# EAGLE design schema (EAGLE 8.7.1)
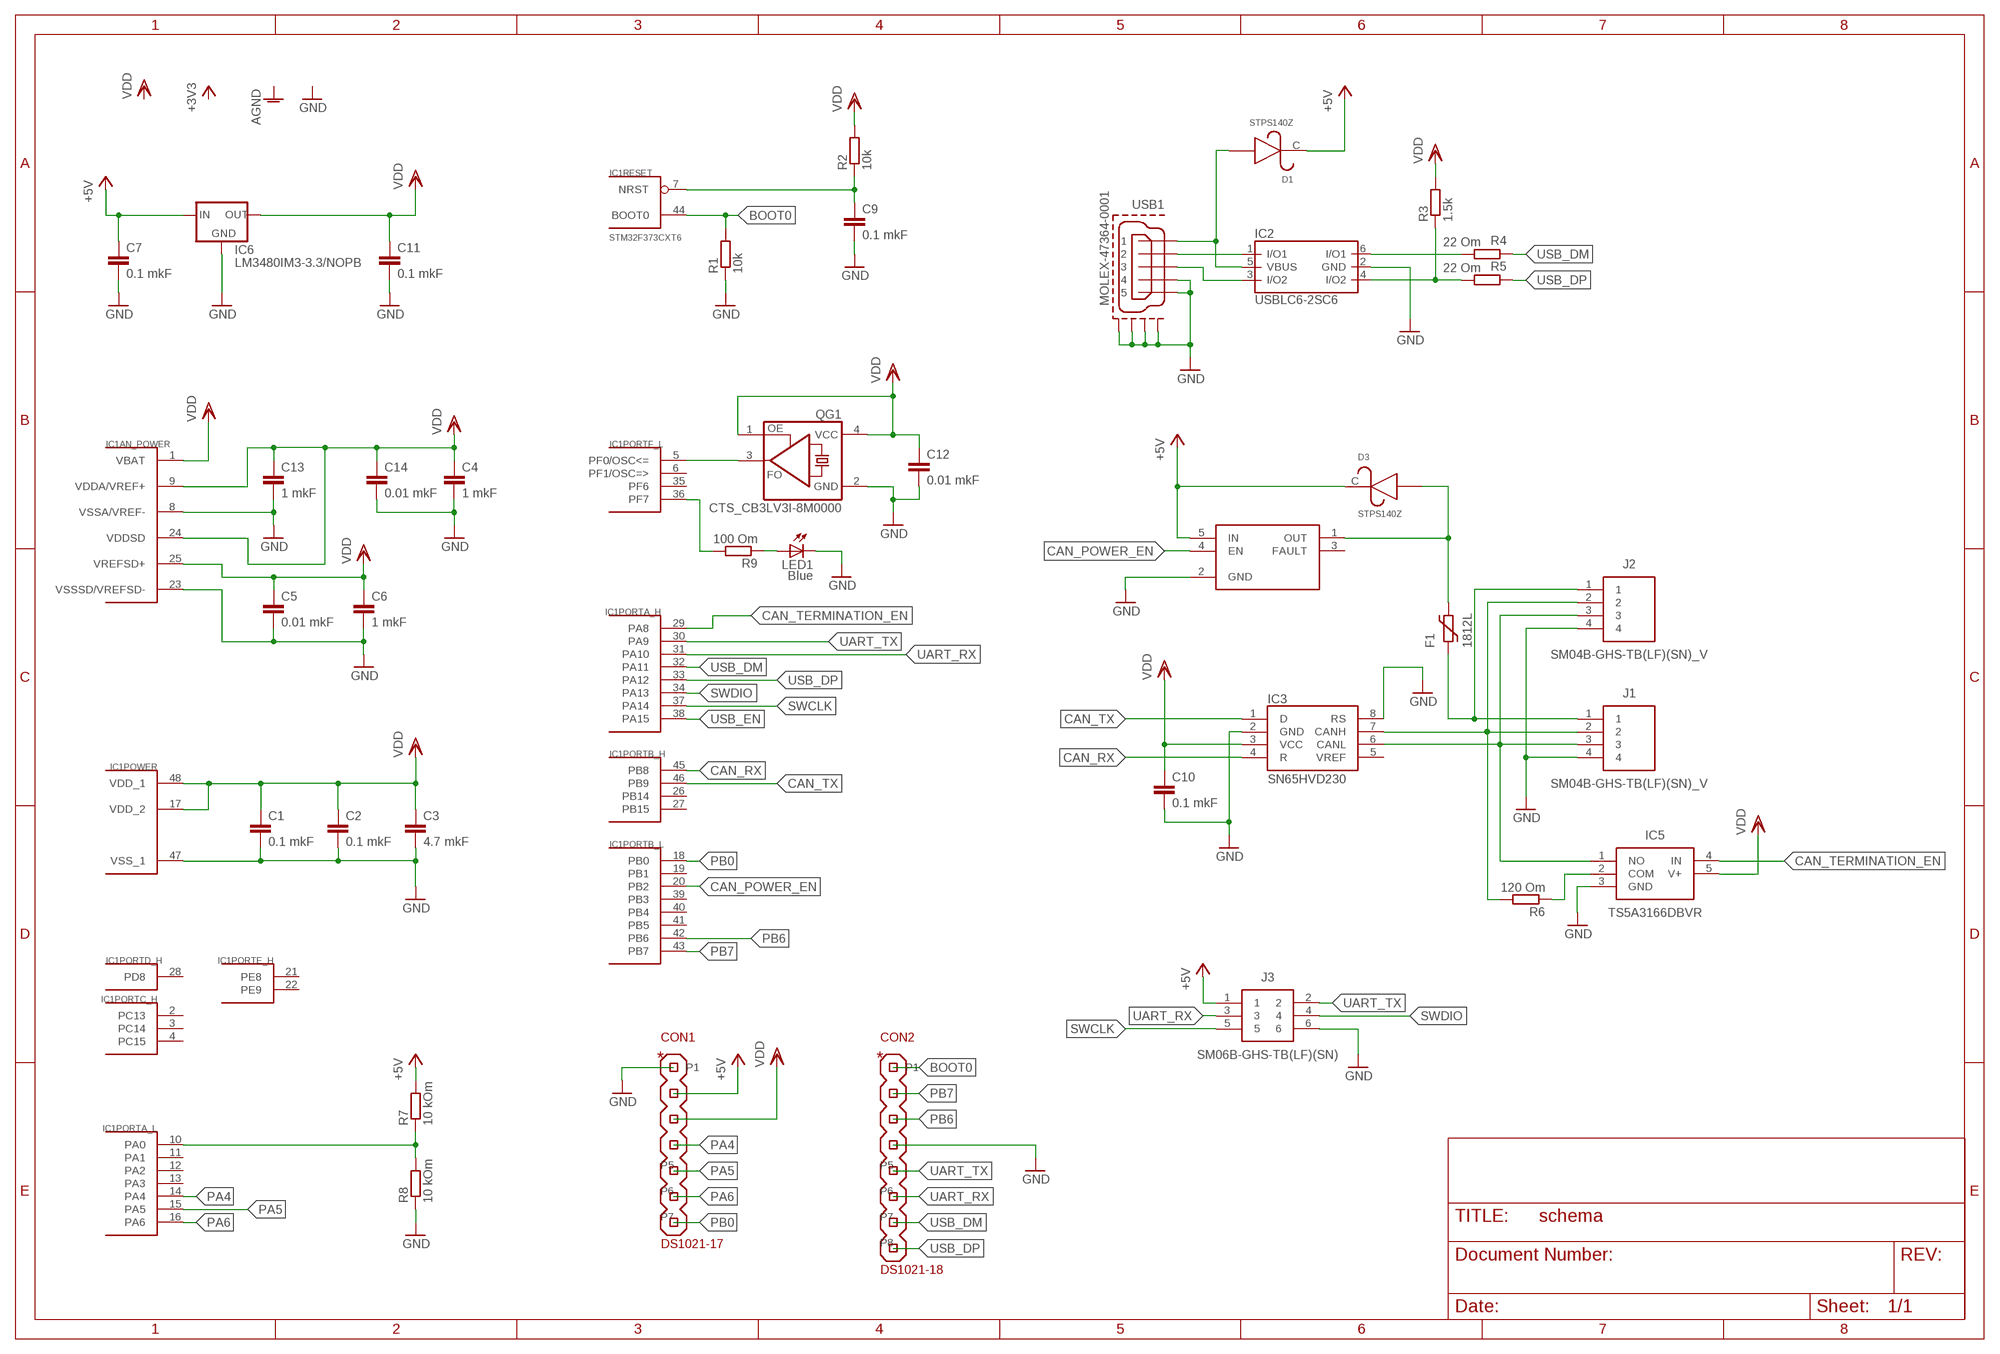
[diagram p0: schematic, sheet 1]

## Parts
C1  0.1 mkF  C-EUC0603  [C0603]
C2  0.1 mkF  C-EUC0603  [C0603]
C3  4.7 mkF  C-EUC0805  [C0805]
C4  1 mkF  C-EUC0603  [C0603]
C5  0.01 mkF  C-EUC0603  [C0603]
C6  1 mkF  C-EUC0603  [C0603]
C7  0.1 mkF  C-EUC0603  [C0603]
C9  0.1 mkF  C-EUC0603  [C0603]
C10  0.1 mkF  C-EUC0603  [C0603]
C11  0.1 mkF  C-EUC0603  [C0603]
C12  0.01 mkF  C-EUC0603  [C0603]
C13  1 mkF  C-EUC0603  [C0603]
C14  0.01 mkF  C-EUC0603  [C0603]
CON1  DS1021-17  [DS1021-1*7]
CON2  DS1021-18  [DS1021-1*8]
D1  STPS140Z  [SOD123]
D3  STPS140Z  [SOD123]
F1  1812L  [1812L]
IC1  STM32F373CXT6  [TQFP48]
IC2  USBLC6-2SC6  [SOT23-6L]
IC3  SN65HVD230  [SO8]
IC5  TS5A3166DBVR  [SOT23-5]
IC6  LM3480IM3-3.3/NOPB  [SOT23]
IC7  STMPS2171STR  [SOT23-5L]
J1  SM04B-GHS-TB(LF)(SN)_V  [SM04B-GHS-TB]
J2  SM04B-GHS-TB(LF)(SN)_V  [SM04B-GHS-TB]
J3  SM06B-GHS-TB(LF)(SN)  [SM06B-GHS-TB]
LED1  Blue  LEDCHIPLED_0603  [CHIPLED_0603]
QG1  CTS_CB3LV3I-8M0000  [CTS_CB3]
R1  10k  R-EU_R0603  [R0603]
R2  10k  R-EU_R0603  [R0603]
R3  1.5k  R-EU_R0603  [R0603]
R4  22 Om  R-EU_R0603  [R0603]
R5  22 Om  R-EU_R0603  [R0603]
R6  120 Om  R-EU_R1206  [R1206]
R7  10 kOm  R-EU_R0603  [R0603]
R8  10 kOm  R-EU_R0603  [R0603]
R9  100 Om  R-EU_R0603  [R0603]
USB1  MOLEX-47364-0001  [MOLEX-47364-0001]

## Nets
+5V: C7.1 CON1.P2 D1.C D3.C IC6.2(IN) IC7.5(IN) J3.1 R7.2
BOOT0: CON2.P1 IC1.44(RESET:BOOT0) R1.2
CAN_POWER_EN: IC1.20(PORTB_L:PB2) IC7.4(EN)
CAN_RX: IC1.45(PORTB_H:PB8) IC3.4(R)
CAN_TERMINATION_EN: IC1.29(PORTA_H:PA8) IC5.4(IN)
CAN_TX: IC1.46(PORTB_H:PB9) IC3.1(D)
GND: C1.2 C2.2 C3.2 C4.2 C5.2 C6.2 C7.2 C9.2 C10.2 C11.2 C12.2 C13.2 C14.2 CON1.P1 CON2.P4 IC1.8(AN_POWER:VSSA/VREF-) IC1.23(AN_POWER:VSSSD/VREFSD-) IC1.47(POWER:VSS_1) IC2.2(GND) IC3.2(GND) IC3.8(RS) IC5.3(GND) IC6.3(GND) IC7.2(GND) J1.4 J2.4 J3.6 LED1.C QG1.2(GND) R1.1 R8.1 USB1.4 USB1.5 USB1.GND1 USB1.GND2 USB1.GND3 USB1.GND4
N$2: C9.1 IC1.7(RESET:NRST) R2.1
N$3: IC1.5(PORTF_L:PF0/OSC<=) QG1.3(FO)
N$4: IC3.7(CANH) J1.2 J2.2 R6.2
N$5: IC2.1(I/O1) USB1.2
N$6: IC2.3(I/O2) USB1.3
N$7: IC2.6(I/O1) R4.2
N$8: IC2.4(I/O2) R3.1 R5.2
N$9: IC3.6(CANL) IC5.1(NO) J1.3 J2.3
N$10: D3.A F1.2 IC7.1(OUT)
N$11: IC5.2(COM) R6.1
N$12: F1.1 J1.1 J2.1
N$13: D1.A IC2.5(VBUS) USB1.1
N$15: IC1.10(PORTA_L:PA0) R7.1 R8.2
N$16: IC1.36(PORTF_L:PF7) R9.2
N$17: LED1.A R9.1
PA4: CON1.P4 IC1.14(PORTA_L:PA4)
PA5: CON1.P5 IC1.15(PORTA_L:PA5)
PA6: CON1.P6 IC1.16(PORTA_L:PA6)
PB0: CON1.P7 IC1.18(PORTB_L:PB0)
PB6: CON2.P3 IC1.42(PORTB_L:PB6)
PB7: CON2.P2 IC1.43(PORTB_L:PB7)
SWCLK: IC1.37(PORTA_H:PA14) J3.5
SWDIO: IC1.34(PORTA_H:PA13) J3.4
UART_RX: CON2.P6 IC1.31(PORTA_H:PA10) J3.3
UART_TX: CON2.P5 IC1.30(PORTA_H:PA9) J3.2
USB_DM: CON2.P7 IC1.32(PORTA_H:PA11) R4.1
USB_DP: CON2.P8 IC1.33(PORTA_H:PA12) R5.1
USB_EN: IC1.38(PORTA_H:PA15)
VDD: C1.1 C2.1 C3.1 C4.1 C5.1 C6.1 C10.1 C11.1 C12.1 C13.1 C14.1 CON1.P3 IC1.1(AN_POWER:VBAT) IC1.9(AN_POWER:VDDA/VREF+) IC1.17(POWER:VDD_2) IC1.24(AN_POWER:VDDSD) IC1.25(AN_POWER:VREFSD+) IC1.48(POWER:VDD_1) IC3.3(VCC) IC5.5(V+) IC6.1(OUT) QG1.1(OE) QG1.4(VCC) R2.2 R3.2
Unconnected: IC1.2(PORTC_H:PC13) IC1.3(PORTC_H:PC14) IC1.4(PORTC_H:PC15) IC1.6(PORTF_L:PF1/OSC=>) IC1.11(PORTA_L:PA1) IC1.12(PORTA_L:PA2) IC1.13(PORTA_L:PA3) IC1.19(PORTB_L:PB1) IC1.21(PORTE_H:PE8) IC1.22(PORTE_H:PE9) IC1.26(PORTB_H:PB14) IC1.27(PORTB_H:PB15) IC1.28(PORTD_H:PD8) IC1.35(PORTF_L:PF6) IC1.39(PORTB_L:PB3) IC1.40(PORTB_L:PB4) IC1.41(PORTB_L:PB5) IC3.5(VREF) IC7.3(FAULT)

## Library data of the parts
C1-C7 C9-C14 = resistor:C-EU: CAPACITOR, European symbol
CON1 = Конекторы:DS1021-1*7
CON2 = Конекторы:DS1021-1*8
D1 D3 = Диоды:STPS140Z: POWER SCHOTTKY RECTIFIER STMicroelectronics
F1 = ptc-polyfuse:1812L: FUSE
IC1 = stm32:STM32F373CXT6: ST STM32F373CBT6 48pin LQFP
IC2 = st:USBLC6-2SC6: ST Microelectronics USBLC6-2SC6 VERY LOW CAPACITANCE ESD PROTECTION Защитный диод - [SOT-23-6]; Примечание: USB
IC3 = texas_instruments:SN65HVD230
IC5 = texas_instruments:TS5A3166DBVR: Texas Instruments TS5A3166 - 0.9-Ω SPST Analog Switch
IC6 = Texas Instruments:LM3480: Texas Instruments 100 mA, SOT-23, Quasi Low-Dropout Linear Voltage Regulator <https://componentsearchengine.com/Images/3/LM3480IM3-3.3_NOPB.jpg> Source: Datasheet <http://www.ti.com/lit/gpn/lm3480>
IC7 = st:STMPS21: Enhanced single channel power switches STMPS2141, STMPS2151, STMPS2161, STMPS2171
J1 J2 = SM04B-GHS-TB(LF)(SN):SM04B-GHS-TB(LF)(SN)_V: JST GH Series, 1.25mm Pitch 4 Way Right Angle PCB Header, Solder Termination, 1A <https://componentsearchengine.com/Images/3/SM04B-GHS-TB%28LF%29%28SN%29.jpg> Source: Datasheet <http://uk.rs-online.com/web/p/products/7521797>; DESCRIPTION: JST GH Series, 1.25mm Pitch 4 Way Right Angle PCB Header, Solder Termination, 1A; HEIGHT: mm; MANUFACTURER_NAME: JST (JAPAN SOLDERLESS TERMINALS); MANUFACTURER_PART_NUMBER: SM04B-GHS-TB(LF)(SN); RS_PART_NUMBER: 7521797; SUPPLIER_NAME: RS
J3 = SM06B-GHS-TB(LF)(SN):SM06B-GHS-TB(LF)(SN): GH 1.25mm header side entry 6 way JST GH Series, 1.25mm Pitch 6 Way Right Angle PCB Header, Solder Termination, 1A <https://componentsearchengine.com/Images/3/SM06B-GHS-TB%28LF%29%28SN%29.jpg> Source: Datasheet <http://docs-europe.electrocomponents.com/webdocs/13ed/0900766b813ed077.pdf>; DESCRIPTION: GH 1.25mm header side entry 6 way JST GH Series, 1.25mm Pitch 6 Way Right Angle PCB Header, Solder Termination, 1A; HEIGHT: mm; MANUFACTURER_NAME: JST (JAPAN SOLDERLESS TERMINALS); MANUFACTURER_PART_NUMBER: SM06B-GHS-TB(LF)(SN); RS_PART_NUMBER: 7521800; SUPPLIER_NAME: RS
LED1 = led:LED: LED OSRAM: - CHIPLED LG R971, LG N971, LY N971, LG Q971, LY Q971, LO R971, LY R971 LH N974, LH R974 LS Q976, LO Q976, LY Q976 LO Q996 - Hyper CHIPLED LW Q18S LB Q993, LB Q99A, LB R99A - SideLED LS A670, LO A670, LY A670, LG A670, LP A670 LB A673, LV A673, LT A673, LW A673 LH A674 LY A675 LS A676, LA A676, LO A676, LY A676, LW A676 LS A679, LY A679, LG A679 - Hyper Micro SIDELED® LS Y876, LA Y876, LO Y876, LY Y876 LT Y87S - SmartLED LW L88C, LW L88S LB L89C, LB L89S, LG L890 LS L89K, LO L89K, LY L89K LS L896, LA L896, LO L896, LY L896 - TOPLED LS T670, LO T670, LY T670, LG T670, LP T670 LSG T670, LSP T670, LSY T670, LOP T670, LYG T670 LG T671, LOG T671, LSG T671 LB T673, LV T673, LT T673, LW T673 LH T674 LS T676, LA T676, LO T676, LY T676, LB T676, LH T676, LSB T676, LW T676 LB T67C, LV T67C, LT T67C, LS T67K, LO T67K, LY T67K, LW E67C LS E67B, LA E67B, LO E67B, LY E67B, LB E67C, LV E67C, LT E67C LW T67C LS T679, LY T679, LG T679 LS T770, LO T770, LY T770, LG T770, LP T770 LB T773, LV T773, LT T773, LW T773 LH T774 LS E675, LA E675, LY E675, LS T675 LS T776, LA T776, LO T776, LY T776, LB T776 LHGB T686 LT T68C, LB T68C - Hyper Mini TOPLED® LB M676 - Mini TOPLED Santana® LG M470 LS M47K, LO M47K, LY M47K Source: http://www.osram.convergy.de LUXEON: - LUMILED® LXK2-PW12-R00, LXK2-PW12-S00, LXK2-PW14-U00, LXK2-PW14-V00 LXK2-PM12-R00, LXK2-PM12-S00, LXK2-PM14-U00 LXK2-PE12-Q00, LXK2-PE12-R00, LXK2-PE12-S00, LXK2-PE14-T00, LXK2-PE14-U00 LXK2-PB12-K00, LXK2-PB12-L00, LXK2-PB12-M00, LXK2-PB14-N00, LXK2-PB14-P00, LXK2-PB14-Q00 LXK2-PR12-L00, LXK2-PR12-M00, LXK2-PR14-Q00, LXK2-PR14-R00 LXK2-PD12-Q00, LXK2-PD12-R00, LXK2-PD12-S00 LXK2-PH12-R00, LXK2-PH12-S00 LXK2-PL12-P00, LXK2-PL12-Q00, LXK2-PL12-R00 Source: www.luxeon.com KINGBRIGHT: KA-3528ASYC Source: www.kingbright.com
QG1 = Crystals:CTS_CB3LV: CTS CB3LV Exampe: 8MHz - CB3LV-3I-8M0000
R1-R9 = resistor:R-EU_: RESISTOR, European symbol
USB1 = Конекторы:MOLEX-47364-0001: MICRO USB B, BOTTOM MOUNT

## Board
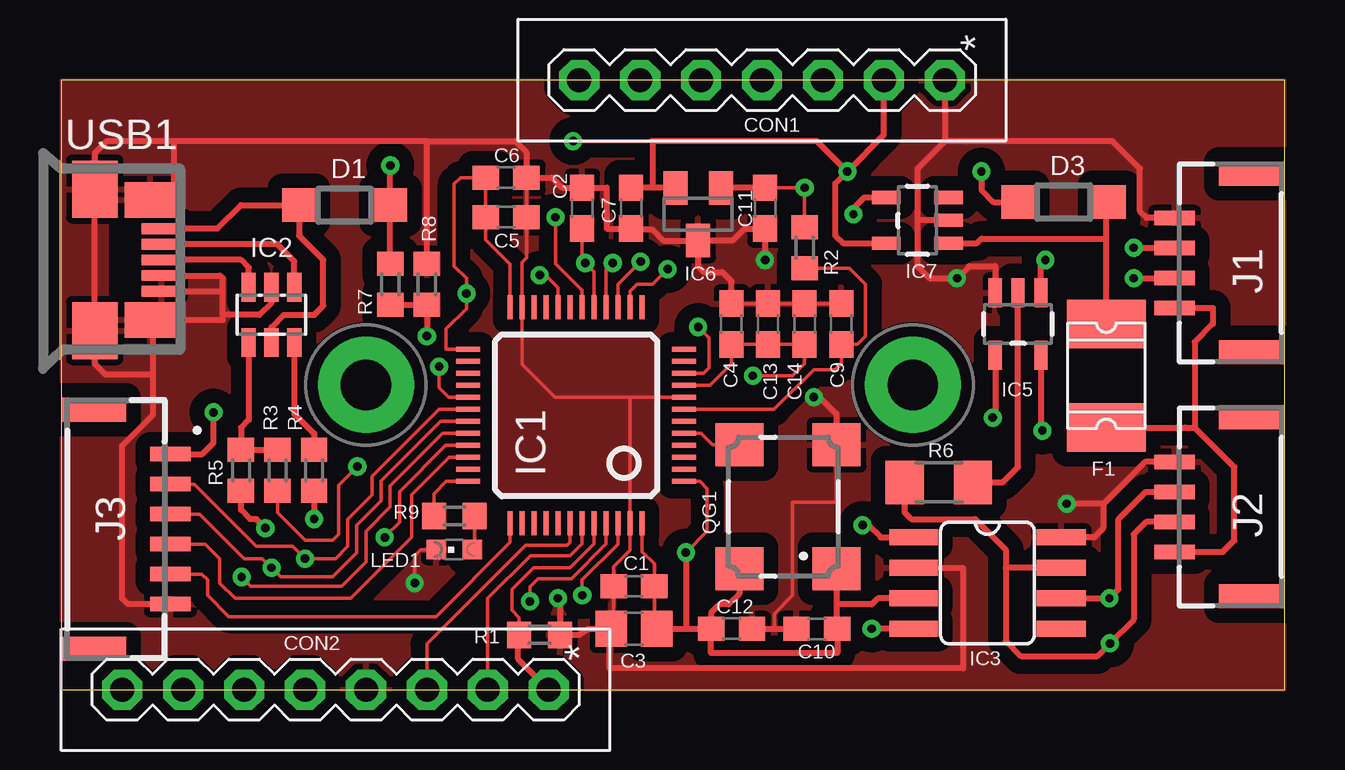
[diagram p1: board, top side]
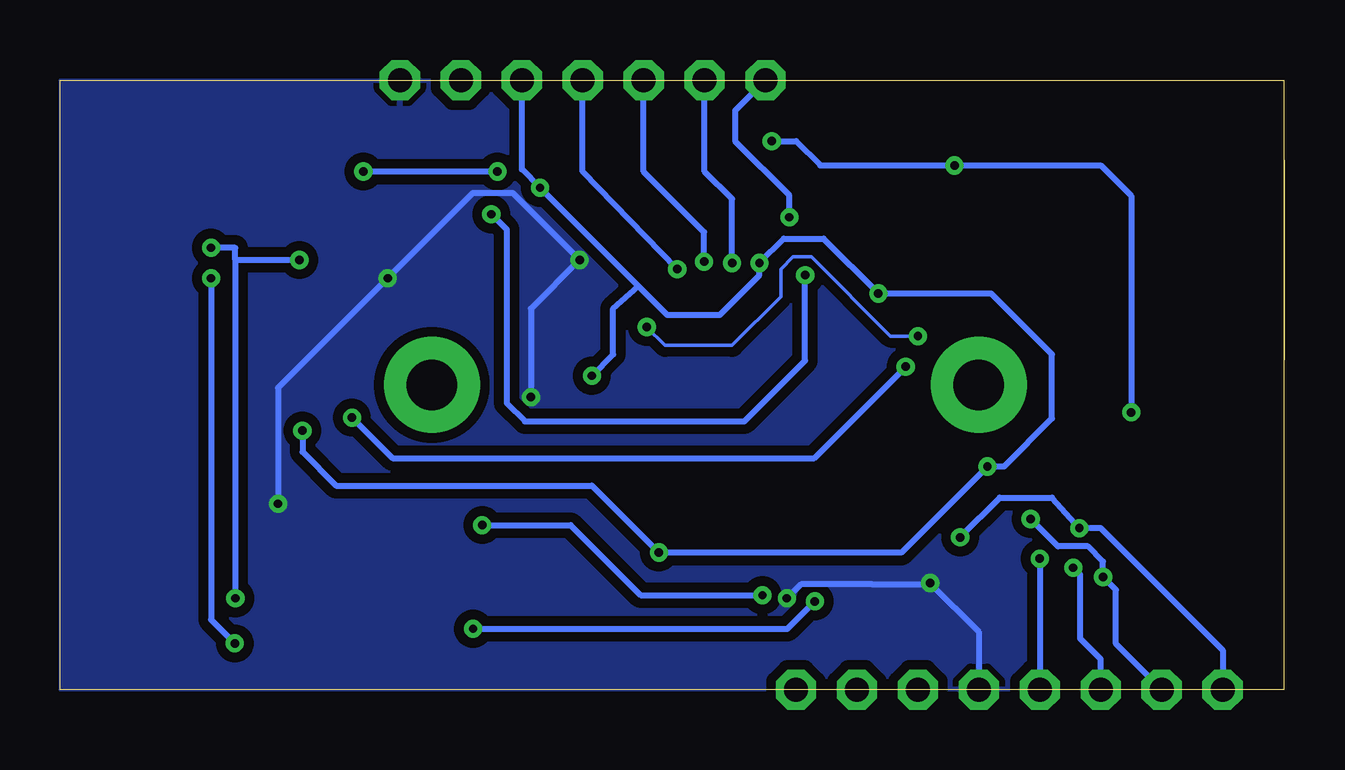
[diagram p2: board, bottom side, seen from below]

Size 51.05 x 25.4 mm. Coordinates in mm from the lower left corner, seen from the top.
Outline: 0.05,0 51.05,0 51.05,25.4 0.05,25.4 0.05,0
Copper layers (1*16): Top 0.035mm / dielectric 1.5mm / Bottom 0.035mm
Design rules "default *": minimum track width 6mil, minimum drill 0.35mm, track to track 6mil, track to pad 6mil, pad to pad 6mil, via to via 6mil, smd to smd 6mil, copper to edge 0mil, drill to drill 6mil, minimum pad ring 10mil, minimum via ring 8mil, stop-mask expansion 4mil, vias tented up to drill 0mil, thermal gap 10mil

### Footprints (pad centres in the part's own frame; a part is rotated, then mirrored left to right if it is on the bottom)
C0603 = smd 1.1 x 1: 1 -0.85,0; 2 0.85,0
C0805 = smd 1.3 x 1.5: 1 -0.95,0; 2 0.95,0
DS1021-1*7 = drill 1 pad 1.676 octagon: P1 2.54,-2.54; P2 2.54,-5.08; P3 2.54,-7.62; P4 2.54,-10.16; P5 2.54,-12.7; P6 2.54,-15.24; P7 2.54,-17.78
DS1021-1*8 = drill 1 pad 1.676 octagon: P1 2.54,-2.54; P2 2.54,-5.08; P3 2.54,-7.62; P4 2.54,-10.16; P5 2.54,-12.7; P6 2.54,-15.24; P7 2.54,-17.78; P8 2.54,-20.32
SOD123 = smd 1.4 x 1.4: A 1.9,0; C -1.9,0
1812L = smd 2.03 x 3.3: 1 -2.16,0; 2 2.16,0
TQFP48 = smd 0.2 x 1: 1 -2.75,-4.5; 2 -2.25,-4.5; 3 -1.75,-4.5; 4 -1.25,-4.5; 5 -0.75,-4.5; 6 -0.25,-4.5; 7 0.25,-4.5; 8 0.75,-4.5; 9 1.25,-4.5; 10 1.75,-4.5; 11 2.25,-4.5; 12 2.75,-4.5; 25 2.75,4.5; 26 2.25,4.5; 27 1.75,4.5; 28 1.25,4.5; 29 0.75,4.5; 30 0.25,4.5; 31 -0.25,4.5; 32 -0.75,4.5; 33 -1.25,4.5; 34 -1.75,4.5; 35 -2.25,4.5; 36 -2.75,4.5 | smd 1 x 0.2: 13 4.5,-2.75; 14 4.5,-2.25; 15 4.5,-1.75; 16 4.5,-1.25; 17 4.5,-0.75; 18 4.5,-0.25; 19 4.5,0.25; 20 4.5,0.75; 21 4.5,1.25; 22 4.5,1.75; 23 4.5,2.25; 24 4.5,2.75; 37 -4.5,2.75; 38 -4.5,2.25; 39 -4.5,1.75; 40 -4.5,1.25; 41 -4.5,0.75; 42 -4.5,0.25; 43 -4.5,-0.25; 44 -4.5,-0.75; 45 -4.5,-1.25; 46 -4.5,-1.75; 47 -4.5,-2.25; 48 -4.5,-2.75
SOT23-6L = smd 0.6 x 1.2: 1 -0.95,-1.15; 2 0,-1.15; 3 0.95,-1.15; 4 0.95,1.15; 5 0.003,1.15; 6 -0.95,1.15
SO8 = smd 0.66 x 2.032: 1 -1.905,-3.073; 2 -0.635,-3.073; 3 0.635,-3.073; 4 1.905,-3.073; 5 1.905,3.073; 6 0.635,3.073; 7 -0.635,3.073; 8 -1.905,3.073
SOT23-5 = smd 0.55 x 1.2: 1 0.32,1.24; 2 1.27,1.24; 3 2.22,1.24; 4 2.22,3.84; 5 0.32,3.84
SOT23 = smd 1 x 1.4: 1 -0.95,-1.1; 2 0.95,-1.1; 3 0,1.1
SOT23-5L = smd 0.55 x 1.2: 1 0.32,1.24; 2 1.27,1.24; 3 2.22,1.24; 4 2.22,3.84; 5 0.32,3.84
SM04B-GHS-TB = smd 0.6 x 1.7: 1 -1.875,0.2; 2 -0.625,0.2; 3 0.625,0.2; 4 1.875,0.2 | smd 1 x 2.7: 5 -3.725,-3; 6 3.725,-3
SM06B-GHS-TB = smd 0.6 x 1.7: 1 2.25,4.3; 2 3.5,4.3; 3 4.75,4.3; 4 6,4.3; 5 7.25,4.3; 6 8.5,4.3 | smd 1 x 2.7: 7 0.4,1.1; 8 10.35,1.1
CHIPLED_0603 = smd 0.8 x 0.8: A 0,-0.75; C 0,0.75
CTS_CB3 = smd 1.8 x 2: 1 -2.581,-2.851; 2 2.581,-2.851; 3 2.581,1.2; 4 -2.581,1.2
R0603 = smd 1 x 1.1: 1 -0.85,0; 2 0.85,0
R1206 = smd 1.6 x 1.803: 1 -1.422,0; 2 1.422,0
MOLEX-47364-0001 = smd 1.7 x 0.45: 1 2.8,1.3; 2 2.8,0.65; 3 2.8,0; 4 2.8,-0.65; 5 2.8,-1.3 | smd 1.9 x 2.375: GND1 0,2.95; GND4 0,-2.95 | smd 2.1 x 1.475: GND2 2.3,2.5; GND3 2.3,-2.5

### Placement (x,y rotation side)
C1  23.93,4.32 180 top
C2  21.77,20.07 90 top
C3  23.93,2.54 180 top
C4  27.99,15.24 90 top
C5  18.6,19.68 0 top
C6  18.6,21.34 0 top
C7  23.8,20.07 270 top
C9  32.56,15.24 90 top
C10  31.55,2.54 180 top
C11  29.39,20.07 270 top
C12  27.99,2.54 0 top
C13  29.52,15.24 90 top
C14  31.04,15.24 90 top
CON1  39.42,27.94 270 top
CON2  22.91,2.54 270 top
D1  11.86,20.19 180 top
D3  41.84,20.32 0 top
F1  43.61,13.08 90 top
IC1  21.52,11.43 90 top
IC2  8.82,15.62 180 top
IC3  38.66,4.45 270 top
IC5  41.2,17.78 180 top
IC6  26.6,19.81 180 top
IC7  38.28,18.29 90 top
J1  46.66,17.78 90 top
J2  46.66,7.62 90 top
J3  0.31,12.06 270 top
LED1  16.44,5.84 90 top
QG1  29.52,7.62 90 top
R1  19.99,2.29 180 top
R2  31.04,18.41 90 top
R3  9.07,9.14 270 top
R4  10.59,9.14 90 top
R5  7.55,9.14 90 top
R6  36.63,8.64 180 top
R7  13.77,16.89 90 top
R8  15.29,16.89 270 top
R9  16.44,7.24 180 top
USB1  1.45,17.91 0 top

### Tracks (layer width: path | path; a pad name or v marks a point on that pad's centre or on a via)
+5V  (via drill 0.35)
  Top 0.152: 24.69,22.86 v21.39,22.86
  Top 0.254: v38.41,21.59 38.41,20.83 38.91,20.32 D3.C | 24.69,20.92 IC6.2 | 24.69,20.92 C7.1 | v32.82,21.59 34.34,23.11 CON1.P2 | v32.82,21.59 32.31,21.08 32.31,18.92 32.63,18.61 IC7.5 | R7.2 D1.C v13.77,21.84 | v32.82,21.59 31.55,22.86 24.69,22.86 24.69,20.92 | J3.1 5.93,9.81 6.4,10.29 v6.4,11.56
  Bottom 0.254: v32.82,21.59 v38.41,21.59 | v21.39,22.86 20.37,22.86 19.36,21.84 v13.77,21.84 7.67,21.84 6.4,20.57 v6.4,11.56
BOOT0
  Top 0.152: IC1.44 22.27,6.08 21.26,5.08 19.74,5.08 18.85,4.19 18.85,3.3 19.14,3.01 R1.2 19.1,2.25 | 19.23,1.14 19.1,1.27
  Top 0.254: 19.1,2.25 19.1,1.27 CON2.P1
CAN_POWER_EN  (via drill 0.35)
  Top 0.152: IC1.20 20.77,16.75 20.25,17.27 v19.99,17.27
  Top 0.254: IC7.4 33.52,20.51 33.07,20.07 v33.07,19.81
  Bottom 0.254: v33.07,19.81 32.44,19.18 32.44,11.94 31.68,11.18 22.53,11.18 19.99,13.72 v19.99,17.27
CAN_RX  (via drill 0.35)
  Top 0.152: IC1.45 22.77,6.08 21.31,4.62 19.93,4.62 19.59,4.28 v19.59,3.68
  Top 0.254: IC3.4 v33.83,2.54
  Bottom 0.254: v33.83,2.54 20.73,2.54 v19.59,3.68
CAN_TERMINATION_EN  (via drill 0.35)
  Top 0.152: v15.8,13.46 15.8,12.57 16.19,12.18 IC1.29
  Top 0.254: v38.88,11.34 38.98,11.44 IC5.4
  Bottom 0.254: v38.88,11.34 37.2,9.65 19.61,9.65 v15.8,13.46
CAN_TX  (via drill 0.35)
  Top 0.152: IC1.46 23.27,6.07 21.77,4.57 v21.77,3.94
  Top 0.254: IC3.1 34.22,6.35 33.71,6.86 v33.45,6.86
  Bottom 0.254: v33.45,6.86 29.77,6.86 26.85,3.94 v21.77,3.94
GND  (via drill 0.35)
  Top 0.152: 23.21,4.33 C1.2 | 23.77,12.18 IC1.8 | 23.77,12.18 20.64,12.18 19.27,13.55 IC1.23 19.27,17.82 19.45,18 C5.2 C6.2 | 23.77,12.18 IC1.47 23.77,5.81 23.08,5.12 C1.2 | QG1.2 32.37,7.8 30.53,7.8 30.53,3.94 29.77,3.17 29.77,2.54 | C1.2 23.08,2.51 | 15.29,22.86 15.31,22.86 | LED1.C 15.04,5.84 14.79,5.59 v14.79,4.45 | 31.32,16.19 C14.2 | C14.2 C9.2 | C14.2 C13.2 C4.2
  Top 0.254: IC3.8 43.11,6.35 43.49,6.73 43.49,7.75 | 23.08,2.51 C3.2 22.91,2.29 | QG1.2 32.37,11.49 31.66,12.19 v31.42,12.19 | 37.76,22.86 36.88,22.86 | 37.76,22.86 43.87,22.86 45.01,21.72 45.01,19.94 45.29,19.66 J1.4 | CON1.P1 36.88,22.86 | 23.19,4.32 23.21,4.33 | USB1.4 6.67,17.26 6.78,17.14 6.78,16.59 | 6.78,16.59 6.77,16.61 USB1.5 | 4.64,15.41 USB1.GND3 3.86,15.29 3.86,13.14 | 4.62,20.42 USB1.GND2 4.76,20.53 4.76,22.86 | 4.62,15.39 4.64,15.41 | J3.6 2.84,3.56 2.59,3.81 2.59,10.16 3.86,11.43 3.86,13.14 | 4.76,22.86 15.31,22.86 18.98,22.86 19.45,22.39 C6.2 20.5,21.34 20.92,20.92 C2.2 22.79,20.92 22.79,19.22 C7.2 23.84,19.18 24.69,19.18 25.16,18.71 IC6.3 | 37.77,22.85 37.76,22.86 | R8.1 15.29,22.86 | 22.91,2.29 22.91,2.41 22.79,2.54 22.02,2.54 21.64,2.29 R1.1 20.84,3.72 v20.75,3.81 | IC6.3 28.04,18.71 28.5,19.18 29.35,19.18 C11.2 v29.39,17.91 | IC6.3 26.6,17.65 26.85,17.4 27.61,17.4 27.99,17.02 C4.2 | IC3.2 37.64,5.08 37.64,0.89 22.91,0.89 22.91,2.29 | v37.39,17.14 36.25,17.14 35.74,17.65 35.74,19.56 | 36.88,22.86 35.74,21.72 35.74,19.56 | IC7.2 35.74,19.56 | 37.64,17.14 v37.39,17.14 | 4.64,15.41 6.78,15.41 6.78,15.62 | 6.78,15.62 6.78,16.59 | IC2.2 8.82,16.13 8.31,15.62 6.78,15.62 | v37.39,17.14 37.9,17.65 38.98,17.65 IC5.3 | 46.81,9.53 J2.4 45.23,9.49 43.49,7.75 | 43.49,7.75 v41.96,7.75 | 4.76,22.86 1.96,22.86 1.45,22.35 USB1.GND1 USB1.GND4 1.45,13.59 1.9,13.14 3.86,13.14 | C12.2 29.77,2.54 C10.2
  Bottom 0.152: 17.2,4.39 | 14.84,4.39 v14.79,4.45
  Bottom 0.254: v20.75,3.81 20.17,4.39 17.2,4.39 14.84,4.39 | v14.79,4.45 12.75,2.41 CON2.P4 | v41.96,7.75 41.96,12.57 v37.39,17.14 33.83,20.7 32.18,20.7 v29.39,17.91 31.42,15.88 v31.42,12.19
  pour Top (isolate 0.61): 0.05,25.4 51.05,25.4 51.05,0 0.05,0
  pour Bottom (isolate 0.406): 0.05,25.4 51.05,25.4 51.05,0 0.05,0
N$1  (via drill 2.1 pad 4)
  other vias: 35.55,12.7
N$2
  Top 0.152: R2.1 32.91,17.57 33.58,16.89 33.58,14.73 33.24,14.39 C9.1 32.56,13.59 32.31,13.34 31.42,13.34 29.77,11.68 IC1.7
N$3
  Top 0.152: IC1.5 26.71,10.68 27.19,10.2 QG1.3
N$4  (via drill 0.35)
  Top 0.254: 39.42,5.08 39.42,5.84 38.15,7.11 35.49,7.11 35.21,7.39 R6.2 | 39.42,5.08 39.42,2.03 40.06,1.4 43.23,1.4 v43.77,1.93 44.76,2.92 44.76,6.48 45.27,7 J2.2 | v44.76,17.14 46.83,17.14 J1.2 | IC3.7 39.42,5.08
  Bottom 0.254: v43.77,1.93 44.76,2.92 v44.76,17.14
N$5
  Top 0.254: IC2.1 9.77,17.85 9.05,18.56 USB1.2
N$6
  Top 0.254: IC2.3 7.87,17.59 7.55,17.91 USB1.3
N$7
  Top 0.254: R4.2 10.59,10.67 9.77,11.5 IC2.6
N$8
  Top 0.254: R3.1 R5.2 7.55,10.92 7.87,11.24 IC2.4
N$9  (via drill 0.35)
  Top 0.254: v44.76,18.41 46.71,18.41 J1.3 | IC5.1 40.88,17.71 v41.07,17.91 | IC3.6 v43.74,3.81 44.12,4.19 44.12,7.11 45.25,8.24 J2.3
  Bottom 0.254: 43.74,17.91 v41.07,17.91 | 43.74,17.91 43.74,18.41 v44.76,18.41 | 43.74,17.91 v43.74,3.81
N$10
  Top 0.254: 43.61,16.26 F1.2 43.61,18.8 | IC7.1 38.22,18.61 38.41,18.8 43.61,18.8 | 43.61,18.8 43.61,20.2 D3.A
N$11
  Top 0.254: R6.1 39.3,8.64 39.93,9.27 IC5.2
N$12
  Top 0.254: J2.1 48.47,5.75 48.95,6.22 48.95,9.27 47.3,10.92 | 47.3,10.92 47.3,14.48 48.06,15.24 48.06,15.9 J1.1 | F1.1 46.91,10.92 47.3,10.92
N$13
  Top 0.254: USB1.1 6.56,19.21 7.55,20.19 D1.A 9.96,18.92 10.98,17.91 10.98,16 10.59,15.62 9.32,15.62 8.82,15.11 IC2.5
N$14  (via drill 2.1 pad 4)
  other vias: 12.75,12.7
N$15  (via drill 0.35)
  Top 0.152: IC1.10 26.82,13.18 27.05,13.41 27.05,14.66 v26.6,15.11
  Top 0.254: R7.1 R8.2 v15.29,14.73
  Bottom 0.152: v26.6,15.11 25.83,14.35 23.04,14.35 21.01,16.38 21.01,17.53 20.5,18.03 19.74,18.03 16.44,14.73 v15.29,14.73
N$16
  Top 0.152: IC1.36 16.1,8.68 15.59,8.17 R9.2
N$17
  Top 0.152: 17.32,7.07 R9.1 17.29,5.94 LED1.A
PA4  (via drill 0.35)
  Top 0.152: IC1.14 23.77,16.6 24.06,16.89 24.69,16.89 v25.33,17.53
  Bottom 0.254: v25.33,17.53 29.26,21.59 CON1.P4
PA5  (via drill 0.35)
  Top 0.152: IC1.15 23.27,16.9 v24.2,17.84
  Bottom 0.254: v24.2,17.84 24.2,19.07 26.72,21.59 CON1.P5
PA6  (via drill 0.35)
  Top 0.152: IC1.16 22.77,17.51 v23.04,17.78
  Bottom 0.254: v23.04,17.78 23.04,20.45 24.18,21.59 CON1.P6
PB0  (via drill 0.35)
  Top 0.152: IC1.18 21.77,16.64 20.65,17.75 v20.65,19.68
  Bottom 0.254: v20.65,19.68 20.65,20.6 22.91,22.86 22.91,24.13 CON1.P7
PB6
  Top 0.152: IC1.42 21.27,6.15 21.14,6.02 19.41,6.02 15.29,1.91 CON2.P3
PB7
  Top 0.152: IC1.43 21.77,6.09 21.26,5.59 19.61,5.59 17.83,3.81 CON2.P2
SWCLK
  Top 0.152: J3.5 5.91,4.82 6.15,4.57 6.15,3.94 7.04,3.05 15.67,3.05 18.77,6.14 IC1.37
SWDIO
  Top 0.152: IC1.34 16.21,9.68 14.66,8.13 14.66,6.35 12.12,3.81 7.29,3.81 6.66,4.45 6.66,5.46 6.05,6.07 J3.4
UART_RX  (via drill 0.35)
  Top 0.152: IC1.31 15.86,11.18 13.39,8.71 13.39,7.87 12.37,6.86 12.37,5.71 11.36,4.7 9.2,4.7 v8.82,5.08 8.43,5.46 7.67,5.46 5.82,7.32 J3.3
  Bottom 0.254: v8.82,5.08 8.53,4.79 8.53,2.13 7.67,1.27 CON2.P6
UART_TX  (via drill 0.35)
  Top 0.152: IC1.30 15.8,11.68 13.01,8.89 13.01,8.13 11.99,7.11 11.99,5.97 11.48,5.46 v10.21,5.46 9.7,5.97 8.18,5.97 5.58,8.56 J3.2
  Bottom 0.254: v10.21,5.46 CON2.P5
USB_DM  (via drill 0.35)
  Top 0.152: IC1.32 15.94,10.68 13.77,8.51 13.77,7.62 12.75,6.6 12.75,5.33 11.74,4.32 7.96,4.32 v7.57,4.7
  Top 0.254: R4.1 v10.59,7.11
  Bottom 0.254: v10.59,7.11 9.45,5.97 8.21,5.97 7.57,5.33 v7.57,4.7 7.04,4.16 7.04,1.91 CON2.P7
USB_DP  (via drill 0.35)
  Top 0.152: IC1.33 16.07,10.18 14.15,8.26 14.15,6.99 13.54,6.37 v13.54,6.35
  Top 0.254: v8.56,6.73 8.18,7.11 7.93,7.11 7.55,7.49 R5.1
  Bottom 0.254: CON2.P8 2.59,1.65 7.67,6.73 v8.56,6.73 9.7,8 11.88,8 v13.54,6.35
VDD  (via drill 0.35)
  Top 0.152: IC1.24 18.77,17.74 17.75,18.76 C5.1 C6.1 16.69,21.34 16.44,21.08 16.44,17.65 16.94,17.14 v16.94,16.51 16.94,15.88 16.1,15.03 16.1,14.18 IC1.25 | IC1.48 24.27,5.76 24.78,5.25 C1.1 24.78,2.89 | 21.76,18.7 C2.1 21.77,17.91 v21.9,17.78 22.27,17.41 IC1.17 | 26.43,8.68 IC1.1 26.68,8.68 26.98,8.38 26.98,6.6 v26.09,5.71 | C11.1 30.53,20.92 | 30.53,20.91 30.53,20.92 | 30.53,20.92 v31.04,20.92 R2.2 | IC1.9 27.08,12.68 27.99,13.59 C4.1 C13.1 C14.1 31.04,13.59 30.53,13.08 v28.88,13.08 | v12.4,9.3 11.61,8.51 11.61,6.48 11.36,6.22 10.21,6.22 9.07,7.37 R3.2
  Top 0.254: 28.41,5.01 QG1.4 | QG1.4 28.4,5.08 | 24.78,2.89 24.86,2.4 C3.1 26.09,2.54 | C11.1 IC6.1 | v40.95,10.79 40.88,10.92 IC5.5 | QG1.1 32.37,3.56 | 32.37,3.56 32.37,2.57 C10.1 32.4,1.52 27.14,1.52 C12.1 | IC3.3 34.09,3.81 33.83,3.56 32.37,3.56 | 26.09,2.54 C12.1 | v26.09,5.71 26.09,2.54 | QG1.4 28.32,4.01 27.87,3.56 27.48,3.56 27.14,3.21 C12.1
  Bottom 0.254: v40.95,10.79 40.95,9.91 39.55,8.51 28.88,8.51 v26.09,5.71 15.98,5.71 v12.4,9.3 11.71,9.3 9.7,11.3 9.7,13.97 12.25,16.51 v16.94,16.51 19.23,18.8 20.88,18.8 v21.9,17.78 21.9,17.27 23.55,15.62 25.75,15.62 26.93,16.81 | 26.93,16.81 v31.04,20.92 31.8,21.68 CON1.P3 | v28.88,13.08 27.99,13.97 27.99,15.88 26.93,16.81